# Altium project bolid.PrjPcb (part 5 of 6)

## Sheet bolid-iso-motor-control.SchDoc
size A3
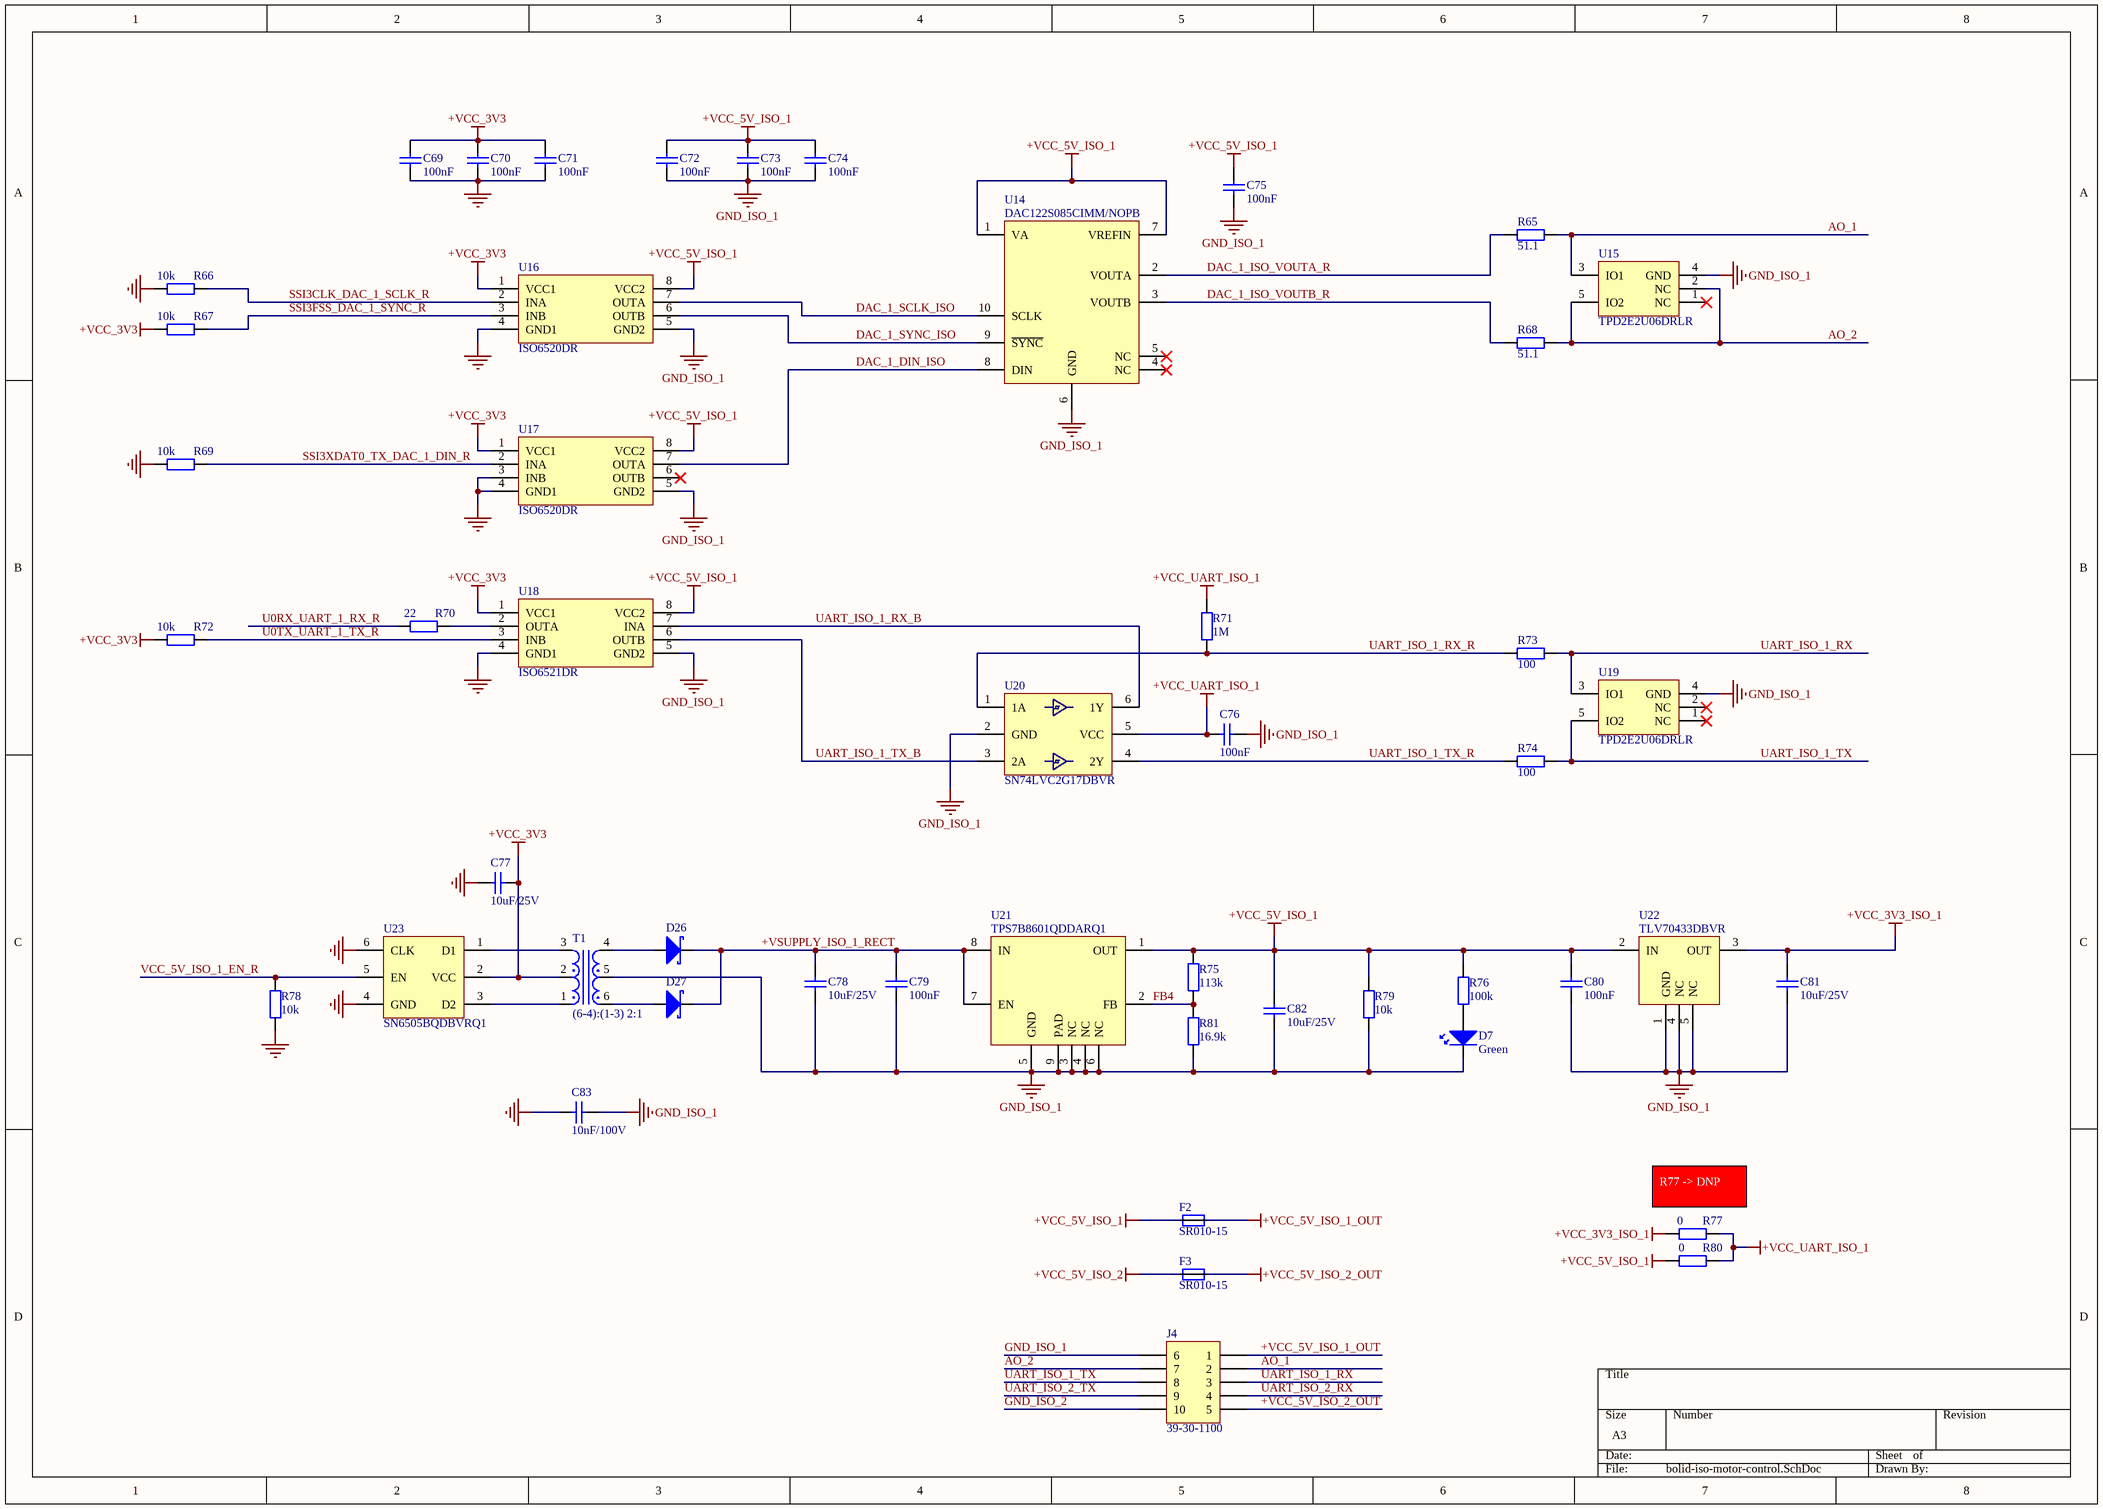
[diagram p8: bolid-iso-motor-control.SchDoc]

### Parts
C69  Value Displayed: 100nF  [C0402-CAPC100X50X55L22 - Tayio Yuden TDK]  (hidden comment: GRM155R71H104KE14D)
C70  Value Displayed: 100nF  [C0402-CAPC100X50X55L22 - Tayio Yuden TDK]  (hidden comment: GRM155R71H104KE14D)
C71  Value Displayed: 100nF  [C0402-CAPC100X50X55L22 - Tayio Yuden TDK]  (hidden comment: GRM155R71H104KE14D)
C72  Value Displayed: 100nF  [C0402-CAPC100X50X55L22 - Tayio Yuden TDK]  (hidden comment: GRM155R71H104KE14D)
C73  Value Displayed: 100nF  [C0402-CAPC100X50X55L22 - Tayio Yuden TDK]  (hidden comment: GRM155R71H104KE14D)
C74  Value Displayed: 100nF  [C0402-CAPC100X50X55L22 - Tayio Yuden TDK]  (hidden comment: GRM155R71H104KE14D)
C75  Value Displayed: 100nF  [C0402-CAPC100X50X55L22 - Tayio Yuden TDK]  (hidden comment: GRM155R71H104KE14D)
C76  Value Displayed: 100nF  [C0402-CAPC100X50X55L22 - Tayio Yuden TDK]  (hidden comment: GRM155R71H104KE14D)
C77  Value Displayed: 10uF/25V  [C1206-CAPC320X160X190L65N - Murata]  (hidden comment: TMK316AB7106KL-T)
C78  Value Displayed: 10uF/25V  [C1206-CAPC320X160X190L65N - Murata]  (hidden comment: TMK316AB7106KL-T)
C79  Value Displayed: 100nF  [C0402-CAPC100X50X55L22 - Tayio Yuden TDK]  (hidden comment: GRM155R71H104KE14D)
C80  Value Displayed: 100nF  [C0402-CAPC100X50X55L22 - Tayio Yuden TDK]  (hidden comment: GRM155R71H104KE14D)
C81  Value Displayed: 10uF/25V  [C1206-CAPC320X160X190L65N - Murata]  (hidden comment: TMK316AB7106KL-T)
C82  Value Displayed: 10uF/25V  [C1206-CAPC320X160X190L65N - Murata]  (hidden comment: TMK316AB7106KL-T)
C83  Value Displayed: 10nF/100V  [C0603-CAPC162X80X95L35N]  (hidden comment: GRM188R72A103KA01J)
D7  Illumination Color: Green  [D0603 DIONC166X84X36L42N Littelfuse]  (hidden comment: 150060GS75000)
D26  MBR0530T3G  [SOD-123-2L SOD375X160X128L32X60N - Fairchild]  (value not drawn)
D27  MBR0530T3G  [SOD-123-2L SOD375X160X128L32X60N - Fairchild]  (value not drawn)
F2  SR010-15  [RESC2214X10N - SR010-15]
F3  SR010-15  [RESC2214X10N - SR010-15]
J4  39-30-1100  [MOLEX Mini-Fit Jr 039301100 2x5 PEG]
R65  value 51.1  [R0402-RESC100X50X40L22N]  (hidden comment: AC0402FR-0751R1L)
R66  value 10k  [R0402-RESC100X50X40L22N]  (hidden comment: RC0402FR-0710KL)
R67  value 10k  [R0402-RESC100X50X40L22N]  (hidden comment: RC0402FR-0710KL)
R68  value 51.1  [R0402-RESC100X50X40L22N]  (hidden comment: AC0402FR-0751R1L)
R69  value 10k  [R0402-RESC100X50X40L22N]  (hidden comment: RC0402FR-0710KL)
R70  value 22  [R0402-RESC100X50X40L22N]  (hidden comment: RC0402FR-1322RL)
R71  value 1M  [R0402-RESC100X50X40L22N]  (hidden comment: AC0402FR-071ML)
R72  value 10k  [R0402-RESC100X50X40L22N]  (hidden comment: RC0402FR-0710KL)
R73  value 100  [R0402-RESC100X50X40L22N]  (hidden comment: RC0402FR-07100RL)
R74  value 100  [R0402-RESC100X50X40L22N]  (hidden comment: RC0402FR-07100RL)
R75  value 113k  [R0402-RESC100X50X40L22N]  (hidden comment: RC0402FR-07113KL)
R76  value 100k  [R0402-RESC100X50X40L22N]  (hidden comment: RC0402FR-07100KL)
R77  value 0  [R0402-RESC100X50X40L22N]  (hidden comment: RC0402JR-7D0RL)
R78  value 10k  [R0402-RESC100X50X40L22N]  (hidden comment: RC0402FR-0710KL)
R79  value 10k  [R0402-RESC100X50X40L22N]  (hidden comment: RC0402FR-0710KL)
R80  value 0  [R0402-RESC100X50X40L22N]  (hidden comment: RC0402JR-7D0RL)
R81  value 16.9k  [R0402-RESC100X50X40L22N]  (hidden comment: RC0402FR-0716K9L)
T1  value (6-4):(1-3) 2:1  [WE 760390014]  (hidden comment: 760390015)
U14  DAC122S085CIMM/NOPB  [TI VSSOP10 DGS0010A TSSOP50P490X110-10N]
U15  TPD2E2U06DRLR  [TI SOT-5X3 DRL0005A SOTFL50P160X60-5N]
U16  ISO6520DR  [TI SOIC8 D0008A SOIC8P127_490X599X175L84X41N]
U17  ISO6520DR  [TI SOIC8 D0008A SOIC8P127_490X599X175L84X41N]
U18  ISO6521DR  [TI SOIC8 D0008A SOIC8P127_490X599X175L84X41N]
U19  TPD2E2U06DRLR  [TI SOT-5X3 DRL0005A SOTFL50P160X60-5N]
U20  SN74LVC2G17DBVR  [TI SOT23 DBV0006A SOT23-6P95_280X145L45X37N]
U21  TPS7B8601QDDARQ1  [TI SOIC8 DDA0008E-C01 SOIC127P600X170_HS-9N]
U22  TLV70433DBVR  [TI SOT23 DBV0005A SOT23-5P95_280X145L45X40N]
U23  SN6505BQDBVRQ1  [TI SOT23 DBV0006A SOT23-6P95_280X145L45X37N]

### Nets
+VCC_3V3: C69.2 C70.2 C71.2 C77.2 R67.2 R72.2 T1.2 U16.1(VCC1) U17.1(VCC1) U18.1(VCC1) U23.2(VCC)
+VCC_3V3_ISO_1: C81.2 R77.1 U22.3(OUT)
+VCC_5V_ISO_1: C72.2 C73.2 C74.2 C75.2 C80.2 C82.2 F2.1 R75.2 R76.2 R79.2 R80.1 U14.1(VA) U14.7(VREFIN) U16.8(VCC2) U17.8(VCC2) U18.8(VCC2) U21.1(OUT) U22.2(IN)
+VCC_5V_ISO_1_OUT: F2.2 J4.1
+VCC_5V_ISO_2: F3.1
+VCC_5V_ISO_2_OUT: F3.2 J4.5
+VCC_UART_ISO_1: C76.2 R71.2 R77.2 R80.2 U20.5(VCC)
GND: C69.1 C70.1 C71.1 C77.1 C83.1 R66.2 R69.2 R78.1 U16.4(GND1) U17.3(INB) U17.4(GND1) U18.4(GND1) U23.4(GND) U23.6(CLK)
GND_ISO_1: C72.1 C73.1 C74.1 C75.1 C76.1 C78.1 C79.1 C80.1 C81.1 C82.1 C83.2 D7.1(K) J4.6 R79.1 R81.1 T1.5 U14.6(GND) U15.4(GND) U16.5(GND2) U17.5(GND2) U18.5(GND2) U19.4(GND) U20.2(GND) U21.3(NC) U21.4(NC) U21.5(GND) U21.6(NC) U21.9(PAD) U22.1(GND) U22.4(NC) U22.5(NC)
GND_ISO_2: J4.10
+VSUPPLY_ISO_1_RECT: C78.2 C79.2 D26.1(K) D27.1(K) U21.7(EN) U21.8(IN)
AO_1: J4.2 R65.2 U15.3(IO1)
AO_2: J4.7 R68.2 U15.2(NC) U15.5(IO2)
DAC_1_DIN_ISO: U14.8(DIN) U17.7(OUTA)
DAC_1_ISO_VOUTA_R: R65.1 U14.2(VOUTA)
DAC_1_ISO_VOUTB_R: R68.1 U14.3(VOUTB)
DAC_1_SCLK_ISO: U14.10(SCLK) U16.7(OUTA)
DAC_1_SYNC_ISO: U14.9(~{SYNC}) U16.6(OUTB)
FB4: R75.1 R81.2 U21.2(FB)
SSI3CLK_DAC_1_SCLK_R: R66.1 U16.2(INA)
SSI3FSS_DAC_1_SYNC_R: R67.1 U16.3(INB)
SSI3XDAT0_TX_DAC_1_DIN_R: R69.1 U17.2(INA)
U0RX_UART_1_RX_R: R70.1
U0TX_UART_1_TX_R: R72.1 U18.3(INB)
UART_ISO_1_RX: J4.3 R73.2 U19.3(IO1)
UART_ISO_1_RX_B: U18.7(INA) U20.6(1Y)
UART_ISO_1_RX_R: R71.1 R73.1 U20.1(1A)
UART_ISO_1_TX: J4.8 R74.2 U19.5(IO2)
UART_ISO_1_TX_B: U18.6(OUTB) U20.3(2A)
UART_ISO_1_TX_R: R74.1 U20.4(2Y)
UART_ISO_2_RX: J4.4
UART_ISO_2_TX: J4.9
VCC_5V_ISO_1_EN_R: R78.2 U23.5(EN)
NetD7_2: D7.2(A) R76.1
NetD26_2: D26.2(A) T1.4
NetD27_2: D27.2(A) T1.6
NetR70_2: R70.2 U18.2(OUTA)
NetT1_1: T1.1 U23.3(D2)
NetT1_3: T1.3 U23.1(D1)

Not connected (* = marked no-connect by the designer): U14 4(NC)* 5(NC)*; U15 1(NC)*; U17 6(OUTB)*; U19 1(NC)* 2(NC)*

### Notes on the sheet
- (near R77) R77 -> DNP

### Library data of the parts
C69-C76 C79 C80 = GRM155R71H104KE14D: MLCC 0402 (1005) 100nF 10% 50V X7R; Manufacturer: Murata Electronics; Capacitance: 0.1 uF; Type: Chip Multilayer Ceramic Capacitor for General Purpose; Voltage Rating DC: 50 VDC; Capacitance - pF: 100000 pF; Class: Class 2; Supplier 1: Mouser; Manufacturer Part Number: GRM155R71H104KE14D; RoHS: RoHS Compliant; Category: Multilayer Ceramic Capacitors MLCC - SMD/SMT; Stock 1: 3511637; Pricing 1: 1=0.090, 10=0.038, 100=0.016, 500=0.012, 1000=0.009, 2500=0.008, 5000=0.007, 10000=0.005 (EUR); Height: 0.5 mm; Length: 1 mm; Package / Case: 0402 (1005 metric); Packaging: Cut Tape; Product: General Type MLCCs; Series: GRM; Termination Style: SMD/SMT; Tolerance: 10 %; Width: 0.5 mm; Brand: Murata Electronics; Capacitance - nF: 100 nF; Case Code - in: 0402; Case Code - mm: 1005; Dielectric: X7R; Maximum Operating Temperature: + 125 C; Minimum Operating Temperature: - 55 C; Product Type: Ceramic Capacitors; Standard Pack Qty: 10000; Subcategory: Capacitors; Termination: Standard; RoHS - Mouser: Y; Minimum Order Quantity: 1; Reeling: True; ComponentLink1URL: https://www.mouser.com/datasheet/2/281/murata_03052018_GRM_Series_1-1310166.pdf; ComponentLink1Description: https://www.mouser.com/datasheet/2/281/murata_03052018_GRM_Series_1-1310166.pdf; Value: 100nF; Supplier Part Number 1: 81-GRM155R71H104KE4D
C77 C78 C81 C82 = TMK316AB7106KL-T: MLCC 1206 (3216) 10uF 10% 25V X7R; Manufacturer: Taiyo Yuden; Type: General Purpose; Voltage Rating DC: 25 VDC; Class: Class 2; Value: 10u; Supplier 1: Mouser; Manufacturer Part Number: TMK316AB7106KL-T; RoHS: RoHS Compliant; Category: Multilayer Ceramic Capacitors MLCC - SMD/SMT; Stock 1: 162457; Pricing 1: 1=0.288, 10=0.130, 100=0.087, 500=0.077, 1000=0.068, 2000=0.056 (EUR); Capacitance: 10 uF; Diameter: -; Height: 1.6 mm; Length: 3.2 mm; Package / Case: 1206 (3216 metric); Packaging: Cut Tape; Product: General Type MLCCs; Series: M; Termination Style: SMD/SMT; Tolerance: 10 %; Width: 1.6 mm; Brand: Taiyo Yuden; Case Code - in: 1206; Case Code - mm: 3216; Dielectric: X7R; Maximum Operating Temperature: + 125 C; Minimum Operating Temperature: - 55 C; Product Type: Ceramic Capacitors; Standard Pack Qty: 2000; Subcategory: Capacitors; Termination: Standard; RoHS - Mouser: Y; Minimum Order Quantity: 1; Reeling: True; ComponentLink1URL: https://www.mouser.com/datasheet/2/396/mlcc02_e-1307760.pdf; ComponentLink1Description: https://www.mouser.com/datasheet/2/396/mlcc02_e-1307760.pdf; Supplier Part Number 1: 963-TMK316AB7106KL-T
C83 = GRM188R72A103KA01J: MLCC 0603 (1608) 10nF 10% 100V X7R; Manufacturer: Murata Electronics; Capacitance: 0.01 uF; Type: Chip Multilayer Ceramic Capacitor for General Purpose; Voltage Rating DC: 100 VDC; Capacitance - pF: 10000 pF; Class: Class 2; Value: 10n; Supplier 1: Mouser; Manufacturer Part Number: GRM188R72A103KA01J; RoHS: RoHS Compliant; Category: Multilayer Ceramic Capacitors MLCC - SMD/SMT; Stock 1: 161253; Pricing 1: 1=0.085, 10=0.049, 100=0.021, 500=0.015, 1000=0.011, 5000=0.010, 10000=0.008, 20000=0.007 (EUR); Height: 0.8 mm; Length: 1.6 mm; Package / Case: 0603 (1608 metric); Packaging: Cut Tape; Product: General Type MLCCs; Series: GRM; Termination Style: SMD/SMT; Tolerance: 10 %; Width: 0.8 mm; Brand: Murata Electronics; Capacitance - nF: 10 nF; Case Code - in: 0603; Case Code - mm: 1608; Dielectric: X7R; Maximum Operating Temperature: + 125 C; Minimum Operating Temperature: - 55 C; Product Type: Ceramic Capacitors; Standard Pack Qty: 10000; Subcategory: Capacitors; Termination: Standard; RoHS - Mouser: Y; Minimum Order Quantity: 1; Reeling: True; ComponentLink1URL: https://www.mouser.com/datasheet/2/281/1/GRM188R72A103KA01_01A-1985966.pdf; ComponentLink1Description: https://www.mouser.com/datasheet/2/281/1/GRM188R72A103KA01_01A-1985966.pdf; Supplier Part Number 1: 81-GRM188R72A103KA1J
D7 = 150060GS75000: as D2-D5 on sheet bolid-power-dcdc-ldo; Supplier 1: Mouser; Manufacturer Part Number: 150060GS75000; RoHS: RoHS Compliant; Category: Standard LEDs - SMD; Stock 1: 17312; Pricing 1: 1=0.130, 10=0.126, 50=0.115, 100=0.099, 500=0.085, 4000=0.085 (EUR); Height: 0.7 mm; Length: 1.6 mm; Package / Case: 0603 (1608 metric); Packaging: Cut Tape; Product: Green LEDs; Series: WL-SMCW; Width: 0.8 mm; Brand: Wurth Elektronik; Mounting Style: SMD/SMT; Lens Dimensions: 1.1 mm x 0.8 mm; Lens Transparency: Water Clear; Maximum Operating Temperature: + 85 C; Minimum Operating Temperature: - 40 C; Moisture Sensitive: Yes; Product Type: LED - Standard; Standard Pack Qty: 4000; Subcategory: LEDs; RoHS - Mouser: Y; Minimum Order Quantity: 1; Reeling: True; ComponentLink1URL: https://www.mouser.com/datasheet/2/445/150060GS75000-368921.pdf; ComponentLink1Description: https://www.mouser.com/datasheet/2/445/150060GS75000-368921.pdf; Supplier Part Number 1: 710-150060GS75000
D26 D27 = MBR0530T3G: ON Semi MBR0530T3G; SMT Schottky Diode; 30V 500mA; 2-Pin SOD-123; Manufacturer: ON Semiconductor; Supplier 1: Mouser; Manufacturer Part Number: MBR0530T3G; RoHS: Yes; Category: Schottky Diodes; Stock 1: 167531; Pricing 1: 1=0,19, 10=0,126, 50=0,126, 100=0,065, 1000=0,053, 10000=0,041 (USD); ComponentLink1URL: https://datasheet.ciiva.com/6381/mbr0530t1-d-6381904.pdf?src-supplier=Digikey; ComponentLink1Description: https://datasheet.ciiva.com/6381/mbr0530t1-d-6381904.pdf?src-supplier=Digikey; ComponentLink2URL: https://datasheet.ciiva.com/7962/85890-7962703.pdf?src-supplier=Element14; ComponentLink2Description: https://datasheet.ciiva.com/7962/85890-7962703.pdf?src-supplier=Element14; ComponentLink3URL: https://datasheet.ciiva.com/8294/mbr0530t1-d-8294572.pdf?src-supplier=Avnet; ComponentLink3Description: https://datasheet.ciiva.com/8294/mbr0530t1-d-8294572.pdf?src-supplier=Avnet; ComponentLink4URL: https://datasheet.ciiva.com/15144/getdatasheetpartid-86762-15144599.pdf?src-supplier=Verical; ComponentLink4Description: https://datasheet.ciiva.com/15144/getdatasheetpartid-86762-15144599.pdf?src-supplier=Verical; ComponentLink5URL: https://datasheet.ciiva.com/6381/mbr0530t1-d-6381902.pdf?src-supplier=Digikey; ComponentLink5Description: https://datasheet.ciiva.com/6381/mbr0530t1-d-6381902.pdf?src-supplier=Digikey; Supplier Part Number 1: 863-MBR0530T3G
F2 F3 = SR010-15: PTC Fuse Hold Current 0.10A, Trip Current 0.30A VMax 15V; Manufacturer: Excel Cell; Supplier 1: TME; Manufacturer Part Number: SR010-15; RoHS: No; Stock 1: 5574; Supplier Part Number 1: SR010-15
J4 = 039301100: Molex MiniFit Jr 2x5 Peg Rt Angle Header Tin Plate W/pcb Mount Peg 94V-2 10 Circt | Molex Incorporated 39-30-1100; Number of Circuits: 8NUMBER; Number of Ports: 1NUMBER; Gender: 29Gender; Voltage Rating (DC): 600V; Insulation Resistance: 1GR; Supplier 1: Mouser; Manufacturer: Molex; Manufacturer Part Number: 39-30-1100; RoHS: Yes; Category: Headers and Wire Housings; Stock 1: 3513; Pricing 1: 1=0,85, 10=0,769, 50=0,769, 100=0,739, 1000=0,739, 10000=0,739 (USD); Housing Color: 50Colour; Fastening Type: 192FasteningType; Depth: 19.4mm; Lead Free: 5697LeadFree; ComponentLink1URL: https://datasheet.ciiva.com/30070/136790039301100-pcb-headers-30070445.pdf?src-supplier=Onlinecomponents.com; ComponentLink1Description: https://datasheet.ciiva.com/30070/136790039301100-pcb-headers-30070445.pdf?src-supplier=Onlinecomponents.com; ComponentLink2URL: https://datasheet.ciiva.com/11748/0900766b805f2c40-11748682.pdf?src-supplier=Rs; ComponentLink2Description: https://datasheet.ciiva.com/11748/0900766b805f2c40-11748682.pdf?src-supplier=Rs; Supplier Part Number 1: 538-39-30-1100
R65 R68 = AC0402FR-0751R1L: RES 0402 (1005) 51.1 ohm 1% 0.0625W 50V Thick Film; Manufacturer: Yageo; Power Rating: 62.5mW; Resistance: 51.1R; Max Power Dissipation: 63mW; Temperature Coefficient: 100ppm/°C; Supplier 1: Mouser; Manufacturer Part Number: AC0402FR-0751R1L; RoHS: Yes; Category: Chip SMD Resistors; Stock 1: 57995; Pricing 1: 1=0,10000, 10=0,01500, 50=0,01500, 100=0,00700, 1000=0,00300, 10000=0,00200 (USD); Case/Package: 0402; Case Code (Imperial): 0402; Case Code (Metric): 1005; Min Operating Temperature: -55°C; Max Operating Temperature: 155°C; Packaging: Tape and Reel; Tolerance: 1%; Voltage Rating: 50V; Resistor Type: Thick Film; Number of Terminations: 2; Termination: SMD/SMT; Features: Moisture Resistant,Automotive AEC-Q200; Series: AC; Length: 0.039inch; Width: 0.02inch; Height: 0.015inch; RoHS Compliant: Yes; ComponentLink1URL: http://www.mouser.com/ds/2/447/yageodocoutput-1111992.pdf?src-supplier=Mouser; ComponentLink1Description: http://www.mouser.com/ds/2/447/yageodocoutput-1111992.pdf?src-supplier=Mouser; ComponentLink2URL: http://www.yageo.com/NewPortal/yageodocoutput?fileName=/pdf/R-Chip/PYu-AC_51_RoHS_L_6.pdf&src-supplier=Digi-Key; ComponentLink2Description: http://www.yageo.com/NewPortal/yageodocoutput?fileName=/pdf/R-Chip/PYu-AC_51_RoHS_L_6.pdf&src-supplier=Digi-Key; Supplier Part Number 1: 603-AC0402FR-0751R1L
R66 R67 R69 R72 R78 R79 = RC0402FR-0710KL: RES 0402 (1005) 10.0k 1% 0.0625W 50V Thick Film; Manufacturer: Yageo; Power Rating: 62.5 mW, 125 mW; Resistance: 10 kOhms; Temperature Coefficient: 100 PPM / C; Supplier 1: Mouser; Manufacturer Part Number: RC0402FR-0710KL; RoHS: RoHS Compliant; Category: Thick Film Resistors - SMD; Stock 1: 20942447; Pricing 1: 1=0.090, 10=0.011, 100=0.004, 1000=0.003, 10000=0.003 (EUR); Application: High Reliability; Features: -; Height: 0.35 mm; Length: 1 mm; Package / Case: -; Packaging: Cut Tape; Product: Thick Film Resistors SMD; Series: RC; Technology: Thick Film; Termination Style: SMD/SMT; Tolerance: 1 %; Type: General Purpose; Voltage Rating: 50 V; Width: 0.5 mm; Brand: Yageo; Mounting Style: PCB Mount; Case Code - in: 0402; Case Code - mm: 1005; Maximum Operating Temperature: + 155 C; Minimum Operating Temperature: - 55 C; Product Type: Thick Film Resistors; Standard Pack Qty: 10000; Subcategory: Resistors; RoHS - Mouser: Y; Minimum Order Quantity: 1; Reeling: True; ComponentLink1URL: https://www.mouser.com/datasheet/2/447/PYu-RC_Group_51_RoHS_L_10-1664068.pdf; ComponentLink1Description: https://www.mouser.com/datasheet/2/447/PYu-RC_Group_51_RoHS_L_10-1664068.pdf; Supplier Part Number 1: 603-RC0402FR-0710KL
R70 = RC0402FR-1322RL: RES 0402 (1005) 22.0 ohm 1% 0.0625W 50V Thick Film; Manufacturer: Yageo; Resistance: 22R; Power Rating: 62.5mW; Temperature Coefficient: 100ppm/°C; Supplier 1: Mouser; Manufacturer Part Number: RC0402FR-1322RL; RoHS: Yes; Category: Chip SMD Resistors; Stock 1: 130563; Pricing 1: 1=0,10000, 10=0,01200, 50=0,01200, 100=0,00500, 1000=0,00300, 10000=0,00300 (USD); Case/Package: 0402; Case Code (Imperial): 0402; Case Code (Metric): 1005; Weight: 2.3E-05oz; Contact Plating: Tin,Matte; Size Code: 0402; Min Operating Temperature: -55°C; Max Operating Temperature: 155°C; Voltage Rating: 50V; Tolerance: 1%; Packaging: Tape and Reel; Resistor Type: Thick Film; Termination: SMD/SMT; Series: RC; Length: 1mm; Width: 0.5mm; Height: 0.35mm; Radiation Hardening: No; Lead Free: Lead Free; RoHS Compliant: Yes; ComponentLink1URL: https://datasheet.ciiva.com/17423/pyu-rc0402-51-rohs-l-6-r-17423721.pdf?src-supplier=Future+Electronics; ComponentLink1Description: https://datasheet.ciiva.com/17423/pyu-rc0402-51-rohs-l-6-r-17423721.pdf?src-supplier=Future+Electronics; ComponentLink2URL: https://datasheet.ciiva.com/8890/pyu-rc0402-51-rohs-l-6-8890187.pdf?src-supplier=Avnet; ComponentLink2Description: https://datasheet.ciiva.com/8890/pyu-rc0402-51-rohs-l-6-8890187.pdf?src-supplier=Avnet; Supplier Part Number 1: 603-RC0402FR-1322RL
R71 = AC0402FR-071ML: RES 0402 (1005) 1.00M 1% 0.0625W 50V Thick Film; Manufacturer: YAGEO; Power Rating: 62.5 mW (1/16 W); Resistance: 1 MOhms; Temperature Coefficient: 100 PPM / C; Qualification: AEC-Q200; Supplier 1: Mouser; Manufacturer Part Number: AC0402FR-071ML; RoHS: RoHS Compliant By Exemption; Category: Thick Film Resistors - SMD; Stock 1: 142366; Pricing 1: 1=0.085, 10=0.019, 100=0.008, 1000=0.004, 2500=0.003, 10000=0.003 (EUR); Application: Automotive Grade; Height: 0.32 mm; Length: 1 mm; Packaging: Cut Tape; Product: Thick Film Resistors General Purpose; Series: AC; Technology: Thick Film; Termination Style: SMD/SMT; Tolerance: 1 %; Type: General Purpose Resistor; Voltage Rating: 50 V; Width: 0.5 mm; Brand: YAGEO; Mounting Style: PCB Mount; Case Code - in: 0402; Case Code - mm: 1005; Maximum Operating Temperature: + 155 C; Minimum Operating Temperature: - 55 C; Product Type: Thick Film Resistors; Standard Pack Qty: 10000; Subcategory: Resistors; RoHS - Mouser: E; Minimum Order Quantity: 1; Reeling: True; ComponentLink1URL: https://www.mouser.com/datasheet/2/447/Yageo_PYu_AC_51_RoHS_L_7_1714230-1874691.pdf; ComponentLink1Description: https://www.mouser.com/datasheet/2/447/Yageo_PYu_AC_51_RoHS_L_7_1714230-1874691.pdf; Supplier Part Number 1: 603-AC0402FR-071ML
R73 R74 = RC0402FR-07100RL: RES 0402 (1005) 100.0 ohm 1% 0.0625W 50V Thick Film; Manufacturer: Yageo; Power Rating: 62.5 mW, 125 mW; Resistance: 100 Ohms; Temperature Coefficient: 100 PPM / C; Supplier 1: Mouser; Manufacturer Part Number: RC0402FR-07100RL; RoHS: RoHS Compliant; Category: Thick Film Resistors - SMD; Stock 1: 3714956; Pricing 1: 1=0.090, 10=0.011, 100=0.004, 1000=0.003, 10000=0.003 (EUR); Application: High Reliability; Features: -; Height: 0.35 mm; Length: 1 mm; Package / Case: -; Packaging: Cut Tape; Product: Thick Film Resistors SMD; Series: RC; Technology: Thick Film; Termination Style: SMD/SMT; Tolerance: 1 %; Type: General Purpose; Voltage Rating: 50 V; Width: 0.5 mm; Brand: Yageo; Mounting Style: PCB Mount; Case Code - in: 0402; Case Code - mm: 1005; Maximum Operating Temperature: + 155 C; Minimum Operating Temperature: - 55 C; Product Type: Thick Film Resistors; Standard Pack Qty: 10000; Subcategory: Resistors; RoHS - Mouser: Y; Minimum Order Quantity: 1; Reeling: True; ComponentLink1URL: https://www.mouser.com/datasheet/2/447/PYu-RC_Group_51_RoHS_L_10-1664068.pdf; ComponentLink1Description: https://www.mouser.com/datasheet/2/447/PYu-RC_Group_51_RoHS_L_10-1664068.pdf; Supplier Part Number 1: 603-RC0402FR-07100RL
R75 = RC0402FR-07113KL: RES 0402 (1005) 113.0k 1% 0.0625W 50V Thick Film; Manufacturer: Yageo; Supplier 1: Mouser; Manufacturer Part Number: RC0402FR-07113KL; RoHS: Yes; Category: Chip SMD Resistors; Stock 1: 42603; Pricing 1: 1=0,1, 10=0,007, 50=0,007, 100=0,004, 1000=0,003, 10000=0,002 (USD); Voltage Rating (DC): 50V; Lead Free: 5697LeadFree; ComponentLink1URL: https://datasheet.ciiva.com/16744/pyu-rc0402-51-rohs-l-6-r-16744521.pdf?src-supplier=Future+Electronics; ComponentLink1Description: https://datasheet.ciiva.com/16744/pyu-rc0402-51-rohs-l-6-r-16744521.pdf?src-supplier=Future+Electronics; ComponentLink2URL: https://datasheet.ciiva.com/2452/pyu-r-int-thick-7-2452604.pdf?src-supplier=Digikey; ComponentLink2Description: https://datasheet.ciiva.com/2452/pyu-r-int-thick-7-2452604.pdf?src-supplier=Digikey; Supplier Part Number 1: 603-RC0402FR-07113KL
R76 = RC0402FR-07100KL: RES 0402 (1005) 100.0k 1% 0.0625W 50V Thick Film; Manufacturer: Yageo; Power Rating: 62.5 mW, 125 mW; Resistance: 100 kOhms; Temperature Coefficient: 100 PPM / C; Supplier 1: Mouser; Manufacturer Part Number: RC0402FR-07100KL; RoHS: RoHS Compliant; Category: Thick Film Resistors - SMD; Stock 1: 2491111; Pricing 1: 1=0.090, 10=0.011, 100=0.004, 1000=0.003, 10000=0.003 (EUR); Application: High Reliability; Features: -; Height: 0.35 mm; Length: 1 mm; Package / Case: -; Packaging: Cut Tape; Product: Thick Film Resistors SMD; Series: RC; Technology: Thick Film; Termination Style: SMD/SMT; Tolerance: 1 %; Type: General Purpose; Voltage Rating: 50 V; Width: 0.5 mm; Brand: Yageo; Mounting Style: PCB Mount; Case Code - in: 0402; Case Code - mm: 1005; Maximum Operating Temperature: + 155 C; Minimum Operating Temperature: - 55 C; Product Type: Thick Film Resistors; Standard Pack Qty: 10000; Subcategory: Resistors; RoHS - Mouser: Y; Minimum Order Quantity: 1; Reeling: True; ComponentLink1URL: https://www.mouser.com/datasheet/2/447/PYu-RC_Group_51_RoHS_L_10-1664068.pdf; ComponentLink1Description: https://www.mouser.com/datasheet/2/447/PYu-RC_Group_51_RoHS_L_10-1664068.pdf; Supplier Part Number 1: 603-RC0402FR-07100KL
R77 R80 = RC0402JR-7D0RL: RES 0402 (1005) 0.00 ohm 1% 0.0625W 50V Thick Film; Manufacturer: Yageo; Resistance: 0mR; Tolerance: 5%; Supplier 1: Mouser; Manufacturer Part Number: RC0402JR-7D0RL; RoHS: Yes; Category: Chip SMD Resistors; Stock 1: 114874; Pricing 1: 1=0,10000, 10=0,01400, 50=0,01400, 100=0,00600, 1000=0,00300, 10000=0,00200 (USD); Case/Package: 0402; RoHS Compliant: Yes; Supplier Part Number 1: 603-RC0402JR-7D0RL
R81 = RC0402FR-0716K9L: RES 0402 (1005) 16.9k 1% 0.0625W 50V Thick Film; Manufacturer: Yageo; Resistance: 16.9kR; Power Rating: 62.5mW; Max Power Dissipation: 63mW; Temperature Coefficient: 100ppm/°C; Supplier 1: Mouser; Manufacturer Part Number: RC0402FR-0716K9L; RoHS: Yes; Category: Chip SMD Resistors; Stock 1: 109384; Pricing 1: 1=0,1, 10=0,008, 50=0,008, 100=0,005, 1000=0,005, 10000=0,002 (USD); Case/Package: 0402; Case Code (Imperial): 0402; Case Code (Metric): 1005; Contact Plating: Tin,Matte; Size Code: 0402; Min Operating Temperature: -55°C; Max Operating Temperature: 155°C; Package Quantity: 10000; Tolerance: 1%; Voltage Rating: 50V; Packaging: Tape and Reel; Number of Terminations: 2; Termination: SMD/SMT; Voltage Rating (DC): 50V; Features: Moisture Resistant; Series: RC; Length: 0.039inch; Width: 0.5mm; Height: 0.016inch; Lead Free: Lead Free; RoHS Compliant: Yes; ComponentLink1URL: https://datasheet.ciiva.com/12561/pyu-rc0402-51-rohs-l-6-r-8721-12561757.pdf?src-supplier=Mouser; ComponentLink1Description: https://datasheet.ciiva.com/12561/pyu-rc0402-51-rohs-l-6-r-8721-12561757.pdf?src-supplier=Mouser; ComponentLink2URL: https://datasheet.ciiva.com/17073/pyu-rc0402-51-rohs-l-6-r-17073310.pdf?src-supplier=Future+Electronics; ComponentLink2Description: https://datasheet.ciiva.com/17073/pyu-rc0402-51-rohs-l-6-r-17073310.pdf?src-supplier=Future+Electronics; Supplier Part Number 1: 603-RC0402FR-0716K9L
T1 = 760390015: Transformer 2:1 11VuS 150mAAC Power Transformers MID-SN6501 TI Driver Toroid .475mH 3.3VDC; Manufacturer: Wurth Elektronik / Midcom; Inductance: 475 uH; Operating Frequency: 250 kHz to 550 kHz; Power Rating: 1.8 W; Turns Ratio: 0.043055556; Type: Push-Pull; Primary Voltage Rating: 3.3 V; Secondary Current Rating: 350 mA; Secondary Voltage Rating: 5 V; Primary Winding: Dual Primary Winding; Secondary Winding: Dual Secondary Winding; Voltage Time - Et: 11 uVs; Supplier 1: Mouser; Manufacturer Part Number: 760390015; RoHS: RoHS Compliant; Category: Power Transformers; Stock 1: 4102; Pricing 1: 1=1.90, 10=1.71, 50=1.55, 100=1.42, 500=1.34, 1200=1.34 (EUR); Height: 4.19 mm; Length: 6.73 mm; Operating Temperature Range: - 40 C to + 125 C; Packaging: Cut Tape; Product: Power; Series: MID-PPTI; Termination Style: SMD/SMT; Width: 10.05 mm; Brand: Wurth Elektronik / Midcom; Mounting Style: SMD/SMT; Maximum Operating Temperature: + 125 C; Minimum Operating Temperature: - 40 C; Product Type: Audio & Signal Transformers; Standard Pack Qty: 1200; Subcategory: Transformers; RoHS - Mouser: Y; Minimum Order Quantity: 1; Reeling: True; ComponentLink1URL: https://www.mouser.com/datasheet/2/445/760390015-221218.pdf; ComponentLink1Description: https://www.mouser.com/datasheet/2/445/760390015-221218.pdf; Supplier Part Number 1: 710-760390015
U14 = DAC122S085CIMM/NOPB: 12-Bit Micro Power DUAL Digital-to-Analog Converter with ail-to- ail Output 10-VSSOP -40 to 105; Manufacturer: TI National Semiconductor; Supplier 1: Mouser; Manufacturer Part Number: DAC122S085CIMM/NOPB; RoHS: Yes; Category: Digital to Analog Converters (DACs); Stock 1: 2044; Pricing 1: 1=5,24, 10=3,75, 50=3,75, 100=3,36, 1000=3,07, 10000=2,94 (USD); ComponentLink1URL: https://datasheet.ciiva.com/41460/001186508-da-01-en-ic-dac-1-dac122s085cimm-nopb-msop-10-tid-41460669.pdf?src-supplier=Conrad; ComponentLink1Description: https://datasheet.ciiva.com/41460/001186508-da-01-en-ic-dac-1-dac122s085cimm-nopb-msop-10-tid-41460669.pdf?src-supplier=Conrad; ComponentLink2URL: https://datasheet.ciiva.com/3041/dac122s085-3041128.pdf?src-supplier=Avnet; ComponentLink2Description: https://datasheet.ciiva.com/3041/dac122s085-3041128.pdf?src-supplier=Avnet; ComponentLink3URL: https://datasheet.ciiva.com/49118/1851000-49118556.pdf?src-supplier=Element14; ComponentLink3Description: https://datasheet.ciiva.com/49118/1851000-49118556.pdf?src-supplier=Element14; ComponentLink4URL: https://datasheet.ciiva.com/15146/getdatasheetpartid-142727-15146634.pdf?src-supplier=Verical; ComponentLink4Description: https://datasheet.ciiva.com/15146/getdatasheetpartid-142727-15146634.pdf?src-supplier=Verical; ComponentLink5URL: https://datasheet.ciiva.com/6665/dac122s085-6665055.pdf?src-supplier=Digikey; ComponentLink5Description: https://datasheet.ciiva.com/6665/dac122s085-6665055.pdf?src-supplier=Digikey; Supplier Part Number 1: 926-DAC122S085CIMMNO
U15 U19 = TPD2E2U06DRLR: TVS DIODE 5.5VWM 12.4VC 5SOT; Manufacturer: Texas Instruments; Direction: Unidirectional; Capacitance: 1.9pF; Reverse Standoff Voltage: 5.5V; Min Breakdown Voltage: 6.5V; Clamping Voltage: 12.4V; Peak Pulse Power: 85W; Power Line Protection: Yes; Breakdown Voltage: 8.5V; Peak Pulse Current: 5.5A; Number of Channels: 2; Interface: LVDS,USB,Ethernet; Supplier 1: Mouser; Manufacturer Part Number: TPD2E2U06DRLR; RoHS: Yes; Category: Integrated Circuits (ICs); Stock 1: 73856; Pricing 1: 1=0,49, 10=0,356, 50=0,356, 100=0,254, 1000=0,173, 10000=0,159 (USD); Mount: Surface Mount; Case/Package: SOT-5; Number of Pins: 5; Min Operating Temperature: -40°C; Max Operating Temperature: 125°C; Packaging: Tape and Reel; Working Voltage: 5.5V; Polarity: Unidirectional; Termination: SMD/SMT; Package Quantity: 4000; Series: -; Operating Supply Voltage: 5.5V; Number of Unidirectional Channels: 2; Lead Free: Lead Free; RoHS Compliant: Yes; Reach SVHC Compliant: No; ComponentLink1URL: https://datasheet.ciiva.com/48533/tpd2e2u06-48533343.pdf?src-supplier=Avnet; ComponentLink1Description: https://datasheet.ciiva.com/48533/tpd2e2u06-48533343.pdf?src-supplier=Avnet; Supplier Part Number 1: 595-TPD2E2U06DRLR
U16 U17 = ISO6520DR: Functional isolation dual-channel 2/0 digital isolator 8-SOIC -40 to 125; Manufacturer: Texas Instruments; Supplier 1: Mouser; Manufacturer Part Number: ISO6520DR; RoHS: No; Stock 1: 2904; Pricing 1: 1=1,38, 10=0,862, 50=0,862, 100=0,695, 1000=0,635, 10000=0,549 (USD); Case/Package: SOIC; Number of Pins: 8; Length: 4.9mm; Width: 3.91mm; Height: 1.75mm; Thickness: 1.58mm; Supplier Part Number 1: 595-ISO6520DR
U18 = ISO6521DR: Functional isolation dual-channel 1/1 digital isolator 8-SOIC -40 to 125; Manufacturer: Texas Instruments; Supplier 1: Mouser; Manufacturer Part Number: ISO6521DR; RoHS: No; Stock 1: 2524; Pricing 1: 1=1,38, 10=0,862, 50=0,862, 100=0,695, 1000=0,635, 10000=0,549 (USD); Case/Package: SOIC; Number of Pins: 8; Length: 4.9mm; Width: 3.91mm; Height: 1.75mm; Thickness: 1.58mm; Supplier Part Number 1: 595-ISO6521DR
U20 = SN74LVC2G17DBVR: 2-ch, 1.65-V to 5.5-V buffers with Schmitt-Trigger inputs 6-SOT-23 -40 to 125; Manufacturer: Texas Instruments; Number of Channels: 2; Max Supply Voltage: 5.5V; Min Supply Voltage: 1.65V; Propagation Delay: 4.3ns; Logic Function: Schmitt Trigger,Buffer; Low Level Output Current: 32mA; Polarity: Non-Inverting; Number of Bits per Element: 1; High Level Output Current: -32mA; Turn-On Delay Time: 9.3ns; Quiescent Current: 10uA; Nominal Supply Current: 250mA; Supplier 1: Mouser; Manufacturer Part Number: SN74LVC2G17DBVR; RoHS: Yes; Category: Buffers, Drivers and Transceivers; Stock 1: 195310; Pricing 1: 1=0,17, 10=0,094, 50=0,094, 100=0,063, 1000=0,062, 10000=0,051 (USD); Mount: Surface Mount; Case/Package: SOT-23; Number of Pins: 6; Min Operating Temperature: -40°C; Max Operating Temperature: 125°C; Number of Inputs: 2; Number of Outputs: 2; Packaging: Tape and Reel; Package Quantity: 1; Number of Elements: 2; Number of Input Lines: 2; Number of Output Lines: 2; Termination: SMD/SMT; Number of Gates: 2; Number of Bits: 2; Series: 74LVC; Technology: CMOS; Length: 2.9mm; Width: 1.6mm; Thickness: 1.2mm; Radiation Hardening: No; Reach SVHC Compliant: No; Lead Free: Lead Free; RoHS Compliant: Yes; ComponentLink1URL: https://datasheet.ciiva.com/23943/1772447-23943379.pdf?src-supplier=Newark; ComponentLink1Description: https://datasheet.ciiva.com/23943/1772447-23943379.pdf?src-supplier=Newark; ComponentLink2URL: https://datasheet.ciiva.com/34301/1046318-34301918.pdf?src-supplier=Jameco; ComponentLink2Description: https://datasheet.ciiva.com/34301/1046318-34301918.pdf?src-supplier=Jameco; ComponentLink3URL: https://datasheet.ciiva.com/7744/1781649-7744027.pdf?src-supplier=Element14; ComponentLink3Description: https://datasheet.ciiva.com/7744/1781649-7744027.pdf?src-supplier=Element14; ComponentLink4URL: https://datasheet.ciiva.com/7744/1781649-7744028.pdf?src-supplier=Element14; ComponentLink4Description: https://datasheet.ciiva.com/7744/1781649-7744028.pdf?src-supplier=Element14; ComponentLink5URL: https://datasheet.ciiva.com/28594/1772447-28594828.pdf?src-supplier=Element14; ComponentLink5Description: https://datasheet.ciiva.com/28594/1772447-28594828.pdf?src-supplier=Element14; ComponentLink6URL: https://datasheet.ciiva.com/46439/1857109-46439627.pdf?src-supplier=Element14; ComponentLink6Description: https://datasheet.ciiva.com/46439/1857109-46439627.pdf?src-supplier=Element14; ComponentLink7URL: https://datasheet.ciiva.com/1833/sn74lvc2g17-1833740.pdf?src-supplier=Digikey; ComponentLink7Description: https://datasheet.ciiva.com/1833/sn74lvc2g17-1833740.pdf?src-supplier=Digikey; ComponentLink8URL: https://datasheet.ciiva.com/1833/sn74lvc2g17-1833739.pdf?src-supplier=Digikey; ComponentLink8Description: https://datasheet.ciiva.com/1833/sn74lvc2g17-1833739.pdf?src-supplier=Digikey; ComponentLink9URL: https://datasheet.ciiva.com/1833/sn74lvc2g17-1833741.pdf?src-supplier=Digikey; ComponentLink9Description: https://datasheet.ciiva.com/1833/sn74lvc2g17-1833741.pdf?src-supplier=Digikey; Supplier Part Number 1: 595-SN74LVC2G17DBVR
U21 = TPS7B8601QDDARQ1: Automotive 500-mA, 40-V, ultra-low-IQ, low-dropout (LDO) linear regulator with power good 8-SO PowerPAD -40 to 150; Manufacturer: Texas Instruments; Supplier 1: Mouser; Manufacturer Part Number: TPS7B8601QDDARQ1; RoHS: Yes; Category: Integrated Circuits (ICs); Stock 1: 7087; Pricing 1: 1=2,23, 10=1,45, 50=1,45, 100=1,28, 1000=1,09, 10000=1,02 (USD); RoHS Compliant: Yes; Supplier Part Number 1: 595-TPS7B8601QDDARQ1
U22 = TLV70433DBVR: IC REG LDO 3.3V 0.15A SOT23-5; Manufacturer: Texas Instruments; Supplier 1: Mouser; Manufacturer Part Number: TLV70433DBVR; RoHS: Yes; Category: Voltage Regulators - Linear; Stock 1: 41773; Pricing 1: 1=0,55, 10=0,349, 50=0,349, 100=0,282, 1000=0,259, 10000=0,228 (USD); ComponentLink1URL: https://datasheet.ciiva.com/14278/tlv70433-14278163.pdf?src-supplier=Avnet; ComponentLink1Description: https://datasheet.ciiva.com/14278/tlv70433-14278163.pdf?src-supplier=Avnet; ComponentLink2URL: https://datasheet.ciiva.com/2060/tlv704-2060697.pdf?src-supplier=Digikey; ComponentLink2Description: https://datasheet.ciiva.com/2060/tlv704-2060697.pdf?src-supplier=Digikey; Supplier Part Number 1: 595-TLV70433DBVR
U23 = SN6505BQDBVRQ1: Power Management Specialized - PMIC A 595-SN6505BQDBVTQ1; Manufacturer: Texas Instruments; Input Current: 1.56 mA; Output Current: 1 A; Input Voltage Range: 2.25 V to 5.5 V; Qualification: AEC-Q100; Product Status: New Product; Supplier 1: Mouser; Manufacturer Part Number: SN6505BQDBVRQ1; RoHS: RoHS Compliant; Category: Power Management Specialized - PMIC; Stock 1: 3000; Pricing 1: 1=2.42, 10=2.18, 100=1.78, 250=1.67, 500=1.51, 1000=1.28, 3000=1.22, 6000=1.19 (EUR); Package / Case: SOT-23-6; Packaging: Cut Tape; Product: PMICs; Series: SN6505B-Q1; Type: Low-EMI; Brand: Texas Instruments; Mounting Style: SMD/SMT; Maximum Operating Temperature: + 125 C; Minimum Operating Temperature: - 40 C; Moisture Sensitive: Yes; Operating Supply Current: 1.56 mA; Operating Supply Voltage: 2.25 V to 5.5 V; Product Type: Power Management Specialized - PMIC; Standard Pack Qty: 3000; Subcategory: PMIC - Power Management ICs; RoHS - Mouser: Y; Minimum Order Quantity: 1; Reeling: True; Supplier Part Number 1: 595-SN6505BQDBVRQ1